# EAGLE design 5VPS (EAGLE 9.2.0)
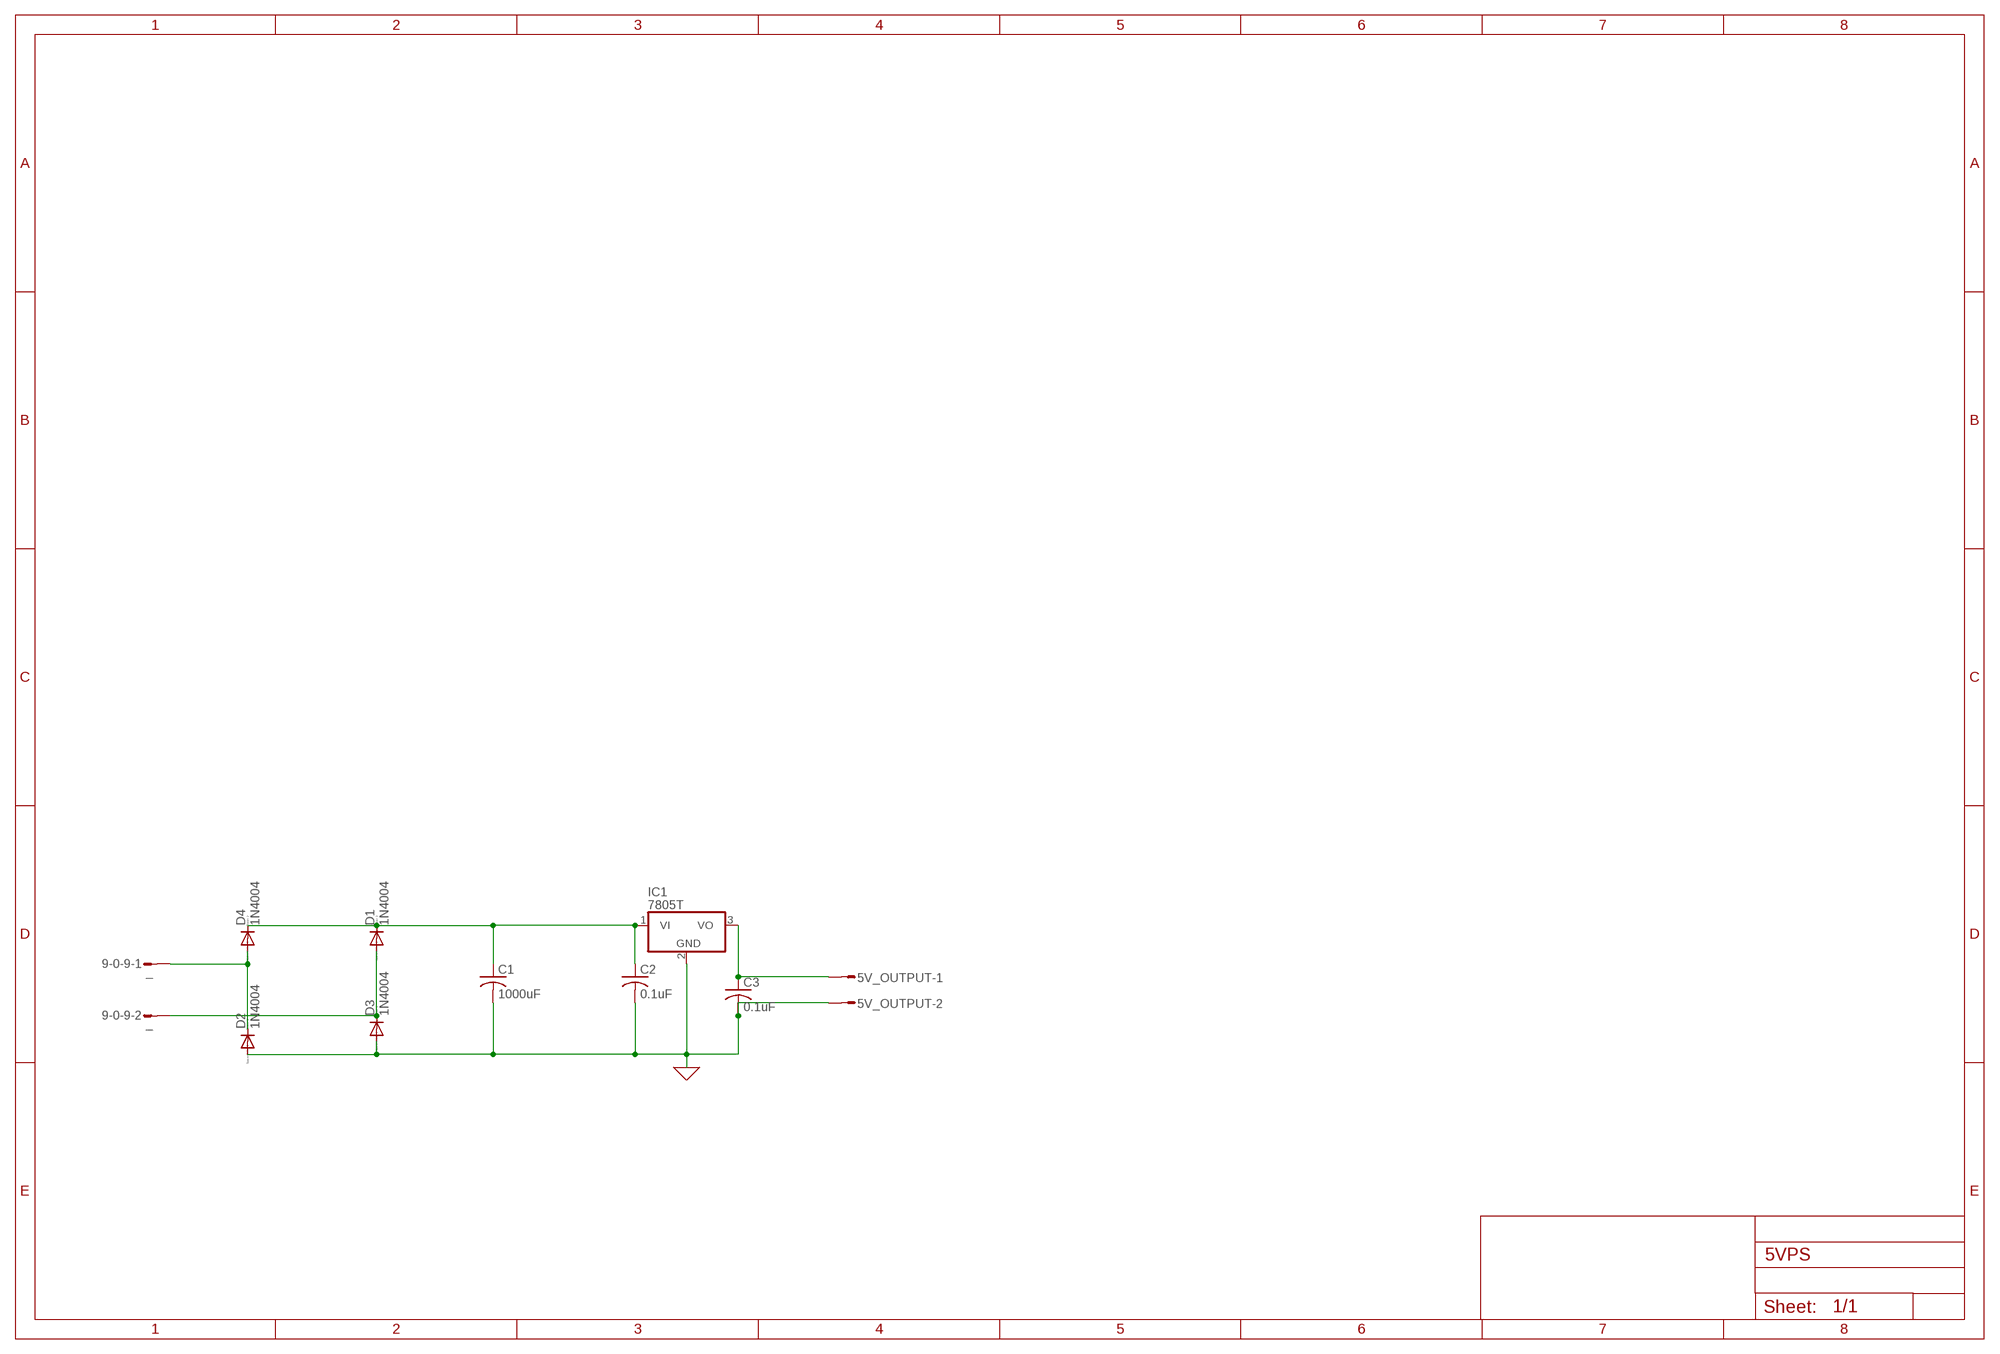
[diagram p0: schematic, sheet 1]

## Parts
5V_OUTPUT  L02P  [L02P]
9-0-9  _  L02P  [L02P]
C1  1000uF  C-US025-030X050  [C025-030X050]
C2  0.1uF  C-US025-024X044  [C025-024X044]
C3  0.1uF  C-US025-024X044  [C025-024X044]
D1  1N4004  [DO41-10]
D2  1N4004  [DO41-10]
D3  1N4004  [DO41-10]
D4  1N4004  [DO41-10]
IC1  7805T  [TO220H]

## Nets
0: 5V_OUTPUT.2 C1.2 C2.2 C3.2 D2.A D3.A IC1.2(GND) ; supply symbol labelled GND
N$1: 9-0-9.1 D2.C D4.A
N$2: C1.1 C2.1 D1.C D4.C IC1.1(VI)
N$3: 5V_OUTPUT.1 C3.1 IC1.3(VO)
N$5: 9-0-9.2 D1.A D3.C

## Library data of the parts
5V_OUTPUT 9-0-9 = con-amp-mt:L02P: AMP MT CONNECTOR; OC_FARNELL: unknown; OC_NEWARK: unknown
C1-C3 = rcl:C-US: CAPACITOR, American symbol; SPICEPREFIX: C
D1-D4 = diode:1N4004: DIODE general purpose rectifier, 1 A
IC1 = linear:78*: Positive VOLTAGE REGULATOR Source: http://cache.national.com/ds/LM/LM78L05.pdf http://www.fairchildsemi.com/ds/LM/LM7805.pdf

## Board
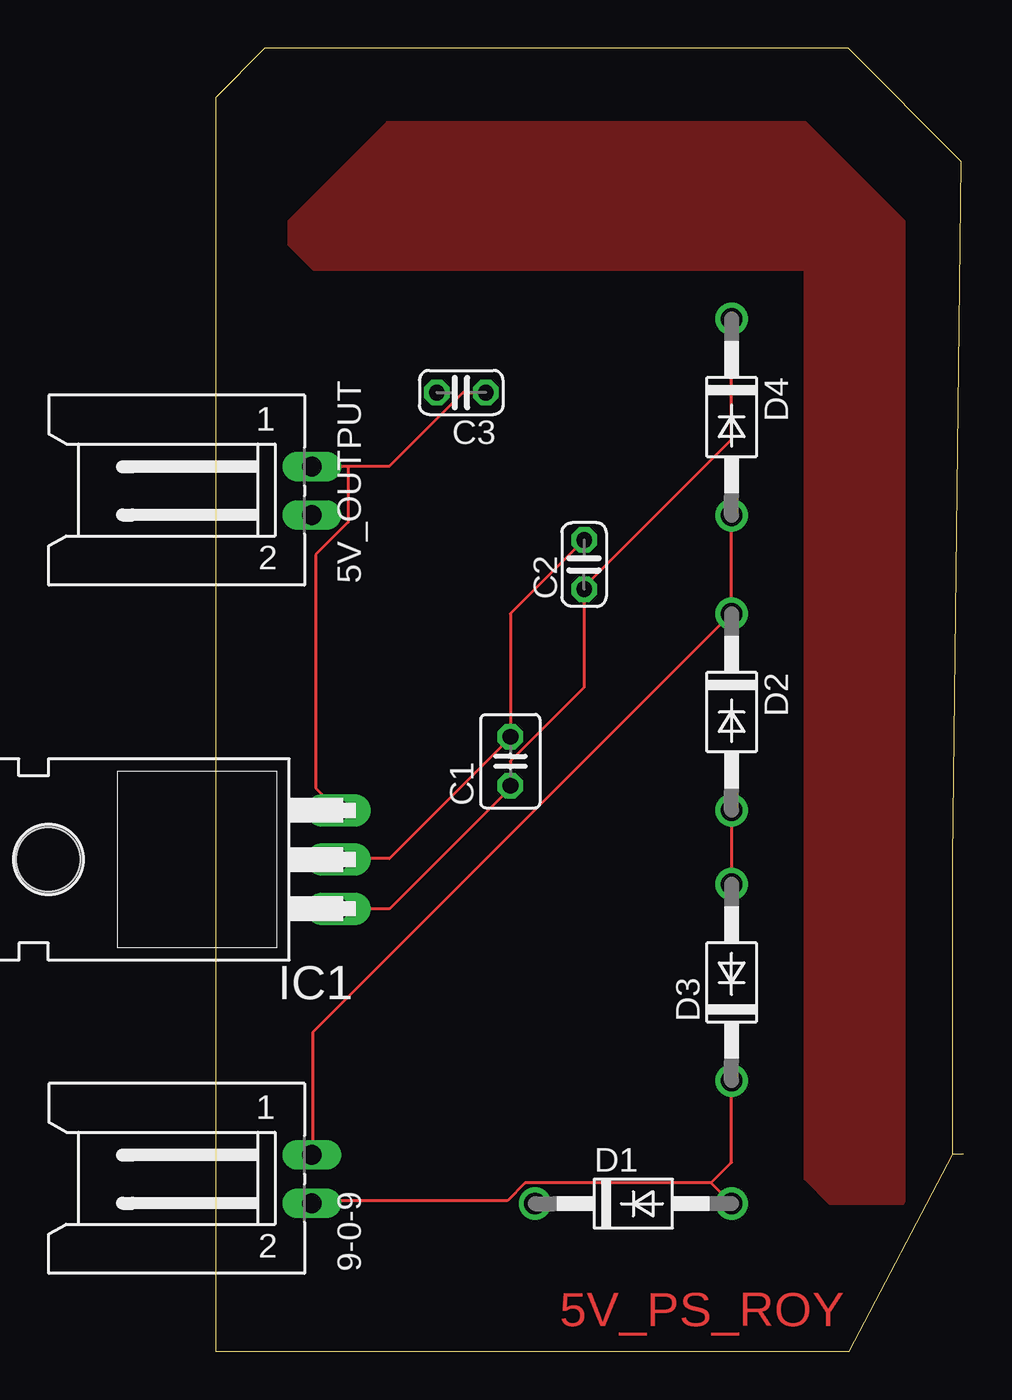
[diagram p1: board, top side]
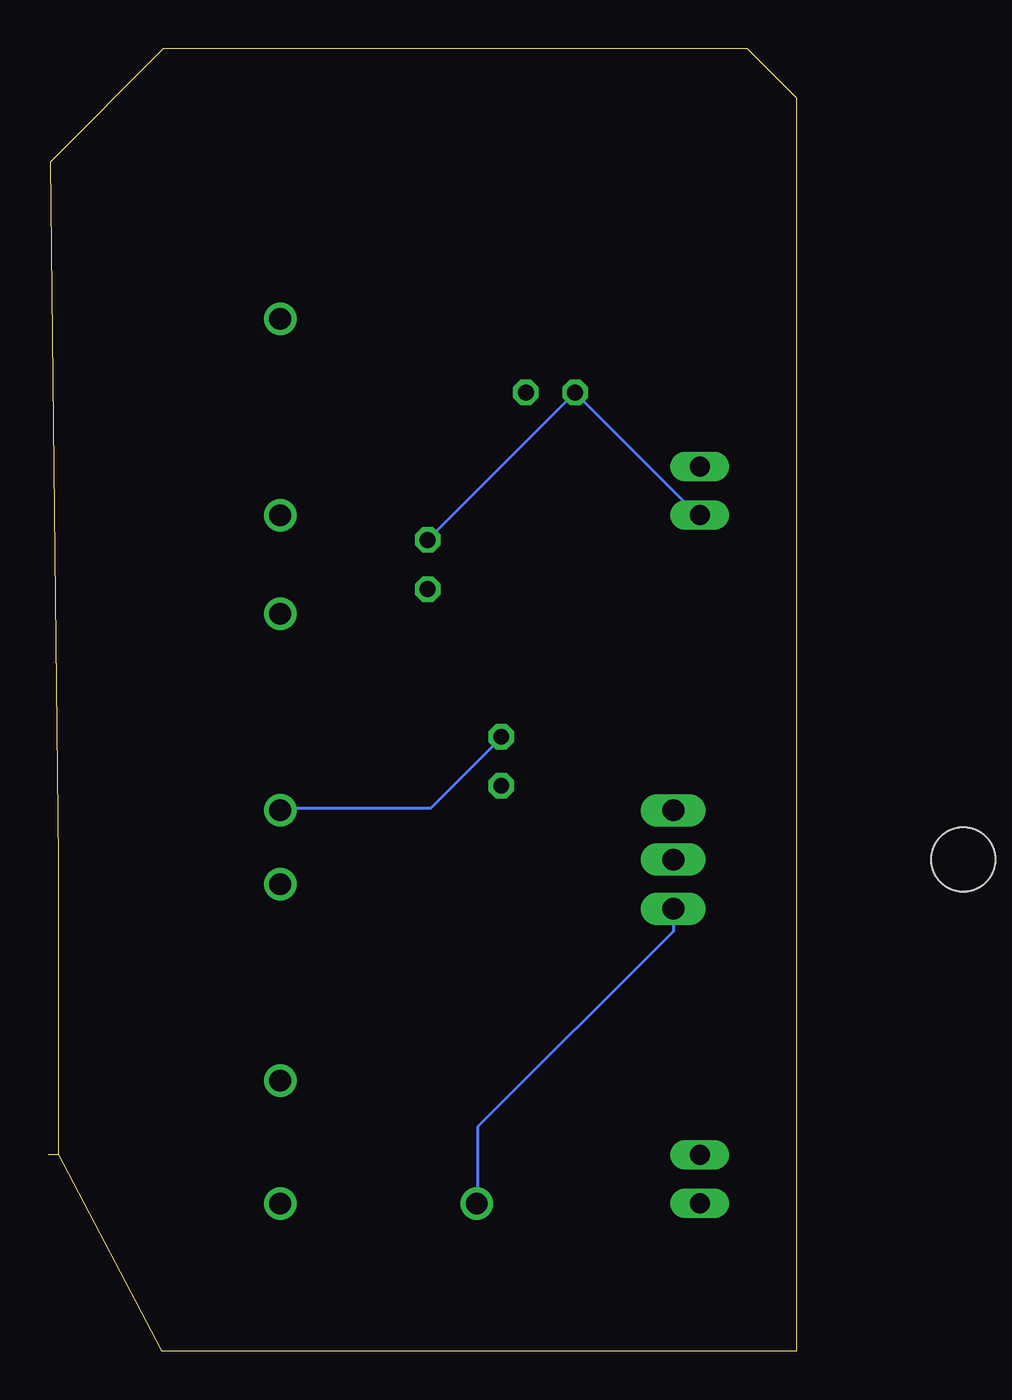
[diagram p2: board, bottom side, seen from below]

Size 38.65 x 67.31 mm. Coordinates in mm from the lower left corner, seen from the top.
Outline: 38.1,10.16 32.76,0 0,0 0,64.77 2.54,67.31 32.69,67.31 38.53,61.47 38.1,25.4 38.1,10.16
Outline: 38.65,10.16 38.1,10.16
Copper layers (1*16): Top 0.035mm / dielectric 1.5mm / Bottom 0.035mm
Design rules "default": minimum track width 6mil, minimum drill 0.35mm, track to track 6mil, track to pad 6mil, pad to pad 6mil, via to via 6mil, smd to smd 6mil, copper to edge 40mil, drill to drill 6mil, minimum pad ring 10mil, minimum via ring 8mil, stop-mask expansion 4mil, vias tented up to drill 0mil, thermal gap 10mil

### Footprints (pad centres in the part's own frame; a part is rotated, then mirrored left to right if it is on the bottom)
L02P = drill 1.016 long: 1 1.25,-6.25; 2 -1.25,-6.25
C025-030X050 = drill 0.813 octagon: 1 -1.27,0; 2 1.27,0
C025-024X044 = drill 0.813 octagon: 1 -1.27,0; 2 1.27,0
DO41-10 = drill 1.118: A 5.08,0; C -5.08,0
TO220H = drill 1.118 long: 1 -2.54,-10.16; 2 0,-10.16; 3 2.54,-10.16 | hole 3.302: 0,4.826

### Placement (x,y rotation side)
5V_OUTPUT  -1.27,44.45 90 top
9-0-9  -1.27,8.89 90 top
C1  15.24,30.48 90 top
C2  19.05,40.64 90 top
C3  12.7,49.53 180 top
D1  21.59,7.62 0 top
D2  26.67,33.02 270 top
D3  26.67,19.05 90 top
D4  26.67,48.26 270 top
IC1  -3.81,25.4 90 top

### Tracks (layer width: path | path; a pad name or v marks a point on that pad's centre or on a via)
0
  Top 0.152: D2.A D3.A | C2.2 15.24,38.1 C1.2 15.24,31.7 8.99,25.45 6.45,25.45 IC1.2
  Bottom 0.152: 5V_OUTPUT.2 5.03,43.13 C3.2 C2.2 | D2.A 26.67,28.04 18.9,28.04 15.24,31.7 C1.2
GND
  pour Top: 3.81,58.42 8.89,63.5 30.48,63.5 33.02,60.96 35.56,58.42 35.56,7.62 31.75,7.62 30.48,8.89 30.48,55.88 5.08,55.88 3.81,57.15
N$1
  Top 0.152: 9-0-9.1 5.03,10.21 5.03,16.46 D2.C D4.A
N$2
  Top 0.152: IC1.1 8.99,22.86 15.24,29.11 C1.1 15.24,30.48 19.05,34.29 C2.1 19.05,39.47 26.67,47.09 D4.C
  Bottom 0.152: D1.C 16.46,7.62 16.46,11.58 6.35,21.69 IC1.1
N$3
  Top 0.152: C3.1 12.8,49.53 8.99,45.72 6.86,45.72 | 6.86,45.72 5.03,45.72 5V_OUTPUT.1 | 6.86,45.72 6.86,42.82 5.18,41.15 5.18,29.11 IC1.3
N$5
  Top 0.152: 25.6,8.69 16,8.69 15.09,7.77 5.03,7.77 9-0-9.2 | D1.A 25.6,8.69 | D3.C 26.67,9.75 25.6,8.69

### Text on the board
Top: 5V_PS_ROY